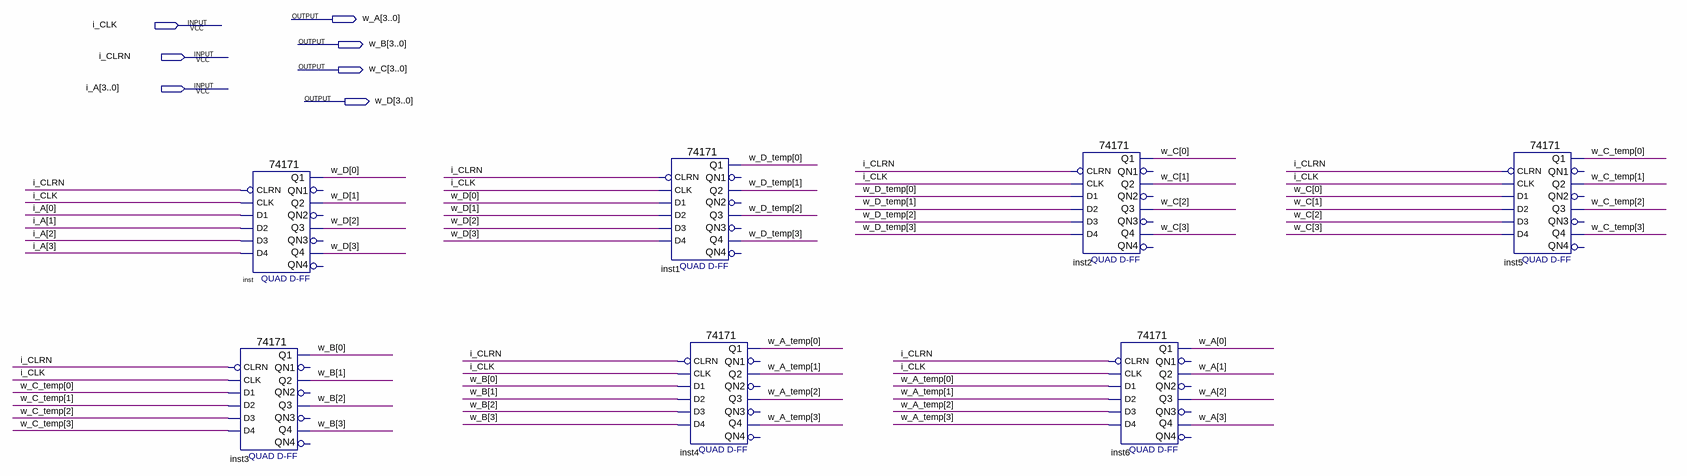
[diagram p0: schematic sheet]
// Quartus schematic shift_register_4bit.bdf as structural Verilog: 7 symbols, 7 pins
module shift_register_4bit (
  input  i_CLK,
  input  i_CLRN,
  input  [3:0] i_A,
  output [3:0] w_A,
  output [3:0] w_B,
  output [3:0] w_C,
  output [3:0] w_D
);

  wire [3:0] w_A_temp, w_C_temp, w_D_temp;

  \74171  inst (
    .CLRN(i_CLRN), .D1(i_A[0]), .CLK(i_CLK), .D2(i_A[1]), .D4(i_A[3]), .D3(i_A[2]), .Q3(w_D[2]), .Q4(w_D[3]),
    .Q2(w_D[1]), .Q1(w_D[0]));  // open: QN4, QN3, QN1, QN2
  \74171  inst3 (
    .CLRN(i_CLRN), .D1(w_C_temp[0]), .CLK(i_CLK), .D2(w_C_temp[1]), .D4(w_C_temp[3]), .D3(w_C_temp[2]),
    .Q3(w_B[2]), .Q4(w_B[3]), .Q2(w_B[1]), .Q1(w_B[0]));  // open: QN4, QN3, QN1, QN2
  \74171  inst1 (
    .CLRN(i_CLRN), .D1(w_D[0]), .CLK(i_CLK), .D2(w_D[1]), .D4(w_D[3]), .D3(w_D[2]), .Q3(w_D_temp[2]),
    .Q4(w_D_temp[3]), .Q2(w_D_temp[1]), .Q1(w_D_temp[0]));  // open: QN4, QN3, QN1, QN2
  \74171  inst4 (
    .CLRN(i_CLRN), .D1(w_B[0]), .CLK(i_CLK), .D2(w_B[1]), .D4(w_B[3]), .D3(w_B[2]), .Q3(w_A_temp[2]),
    .Q4(w_A_temp[3]), .Q2(w_A_temp[1]), .Q1(w_A_temp[0]));  // open: QN4, QN3, QN1, QN2
  \74171  inst2 (
    .CLRN(i_CLRN), .D1(w_D_temp[0]), .CLK(i_CLK), .D2(w_D_temp[1]), .D4(w_D_temp[3]), .D3(w_D_temp[2]),
    .Q3(w_C[2]), .Q4(w_C[3]), .Q2(w_C[1]), .Q1(w_C[0]));  // open: QN4, QN3, QN1, QN2
  \74171  inst6 (
    .CLRN(i_CLRN), .D1(w_A_temp[0]), .CLK(i_CLK), .D2(w_A_temp[1]), .D4(w_A_temp[3]), .D3(w_A_temp[2]),
    .Q3(w_A[2]), .Q4(w_A[3]), .Q2(w_A[1]), .Q1(w_A[0]));  // open: QN4, QN3, QN1, QN2
  \74171  inst5 (
    .CLRN(i_CLRN), .D1(w_C[0]), .CLK(i_CLK), .D2(w_C[1]), .D4(w_C[3]), .D3(w_C[2]), .Q3(w_C_temp[2]),
    .Q4(w_C_temp[3]), .Q2(w_C_temp[1]), .Q1(w_C_temp[0]));  // open: QN4, QN3, QN1, QN2
endmodule
